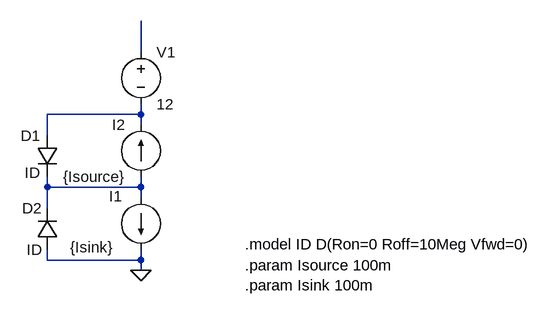
[diagram p0: schematic CLVS.asc]
CLVS.asc, the LTspice schematic file:
Version 4
SHEET 1 880 680
WIRE 96 80 96 32
WIRE 96 176 96 160
WIRE 96 176 -48 176
WIRE 96 192 96 176
WIRE -48 208 -48 176
WIRE -48 288 -48 272
WIRE 96 288 96 272
WIRE 96 288 -48 288
WIRE 96 304 96 288
WIRE -48 320 -48 288
WIRE -48 400 -48 384
WIRE 96 400 96 384
WIRE 96 400 -48 400
WIRE 96 416 96 400
FLAG 96 416 0
SYMBOL voltage 96 64 R0
WINDOW 123 0 0 Left 0
WINDOW 39 0 0 Left 0
SYMATTR InstName V1
SYMATTR Value 12
SYMBOL current 96 304 R0
WINDOW 0 -49 -2 Left 2
WINDOW 3 -109 76 Left 2
WINDOW 123 0 0 Left 0
WINDOW 39 0 0 Left 0
SYMATTR InstName I1
SYMATTR Value {Isink}
SYMBOL current 96 272 R180
WINDOW 0 24 80 Left 2
WINDOW 3 24 0 Left 2
WINDOW 123 0 0 Left 0
WINDOW 39 0 0 Left 0
SYMATTR InstName I2
SYMATTR Value {Isource}
SYMBOL diode -64 208 R0
WINDOW 0 -25 1 Left 2
WINDOW 3 -19 58 Left 2
SYMATTR InstName D1
SYMATTR Value ID
SYMBOL diode -32 384 R180
WINDOW 0 24 64 Left 2
WINDOW 3 24 0 Left 2
SYMATTR InstName D2
SYMATTR Value ID
TEXT 256 376 Left 2 !.model ID D(Ron=0 Roff=10Meg Vfwd=0)
TEXT 256 408 Left 2 !.param Isource 100m\n.param Isink 100m

The netlist it stands for:
* CLVS.asc
V1 N001 N002 12
I1 N003 0 {Isink}
I2 N003 N002 {Isource}
D1 N002 N003 ID
D2 0 N003 ID
.model D D
.lib standard.dio
.model ID D(Ron=0 Roff=10Meg Vfwd=0)
.param Isource 100m
.param Isink 100m
.backanno
.end